# EAGLE design emonTH V1.5.2 (EAGLE 7.0.0)
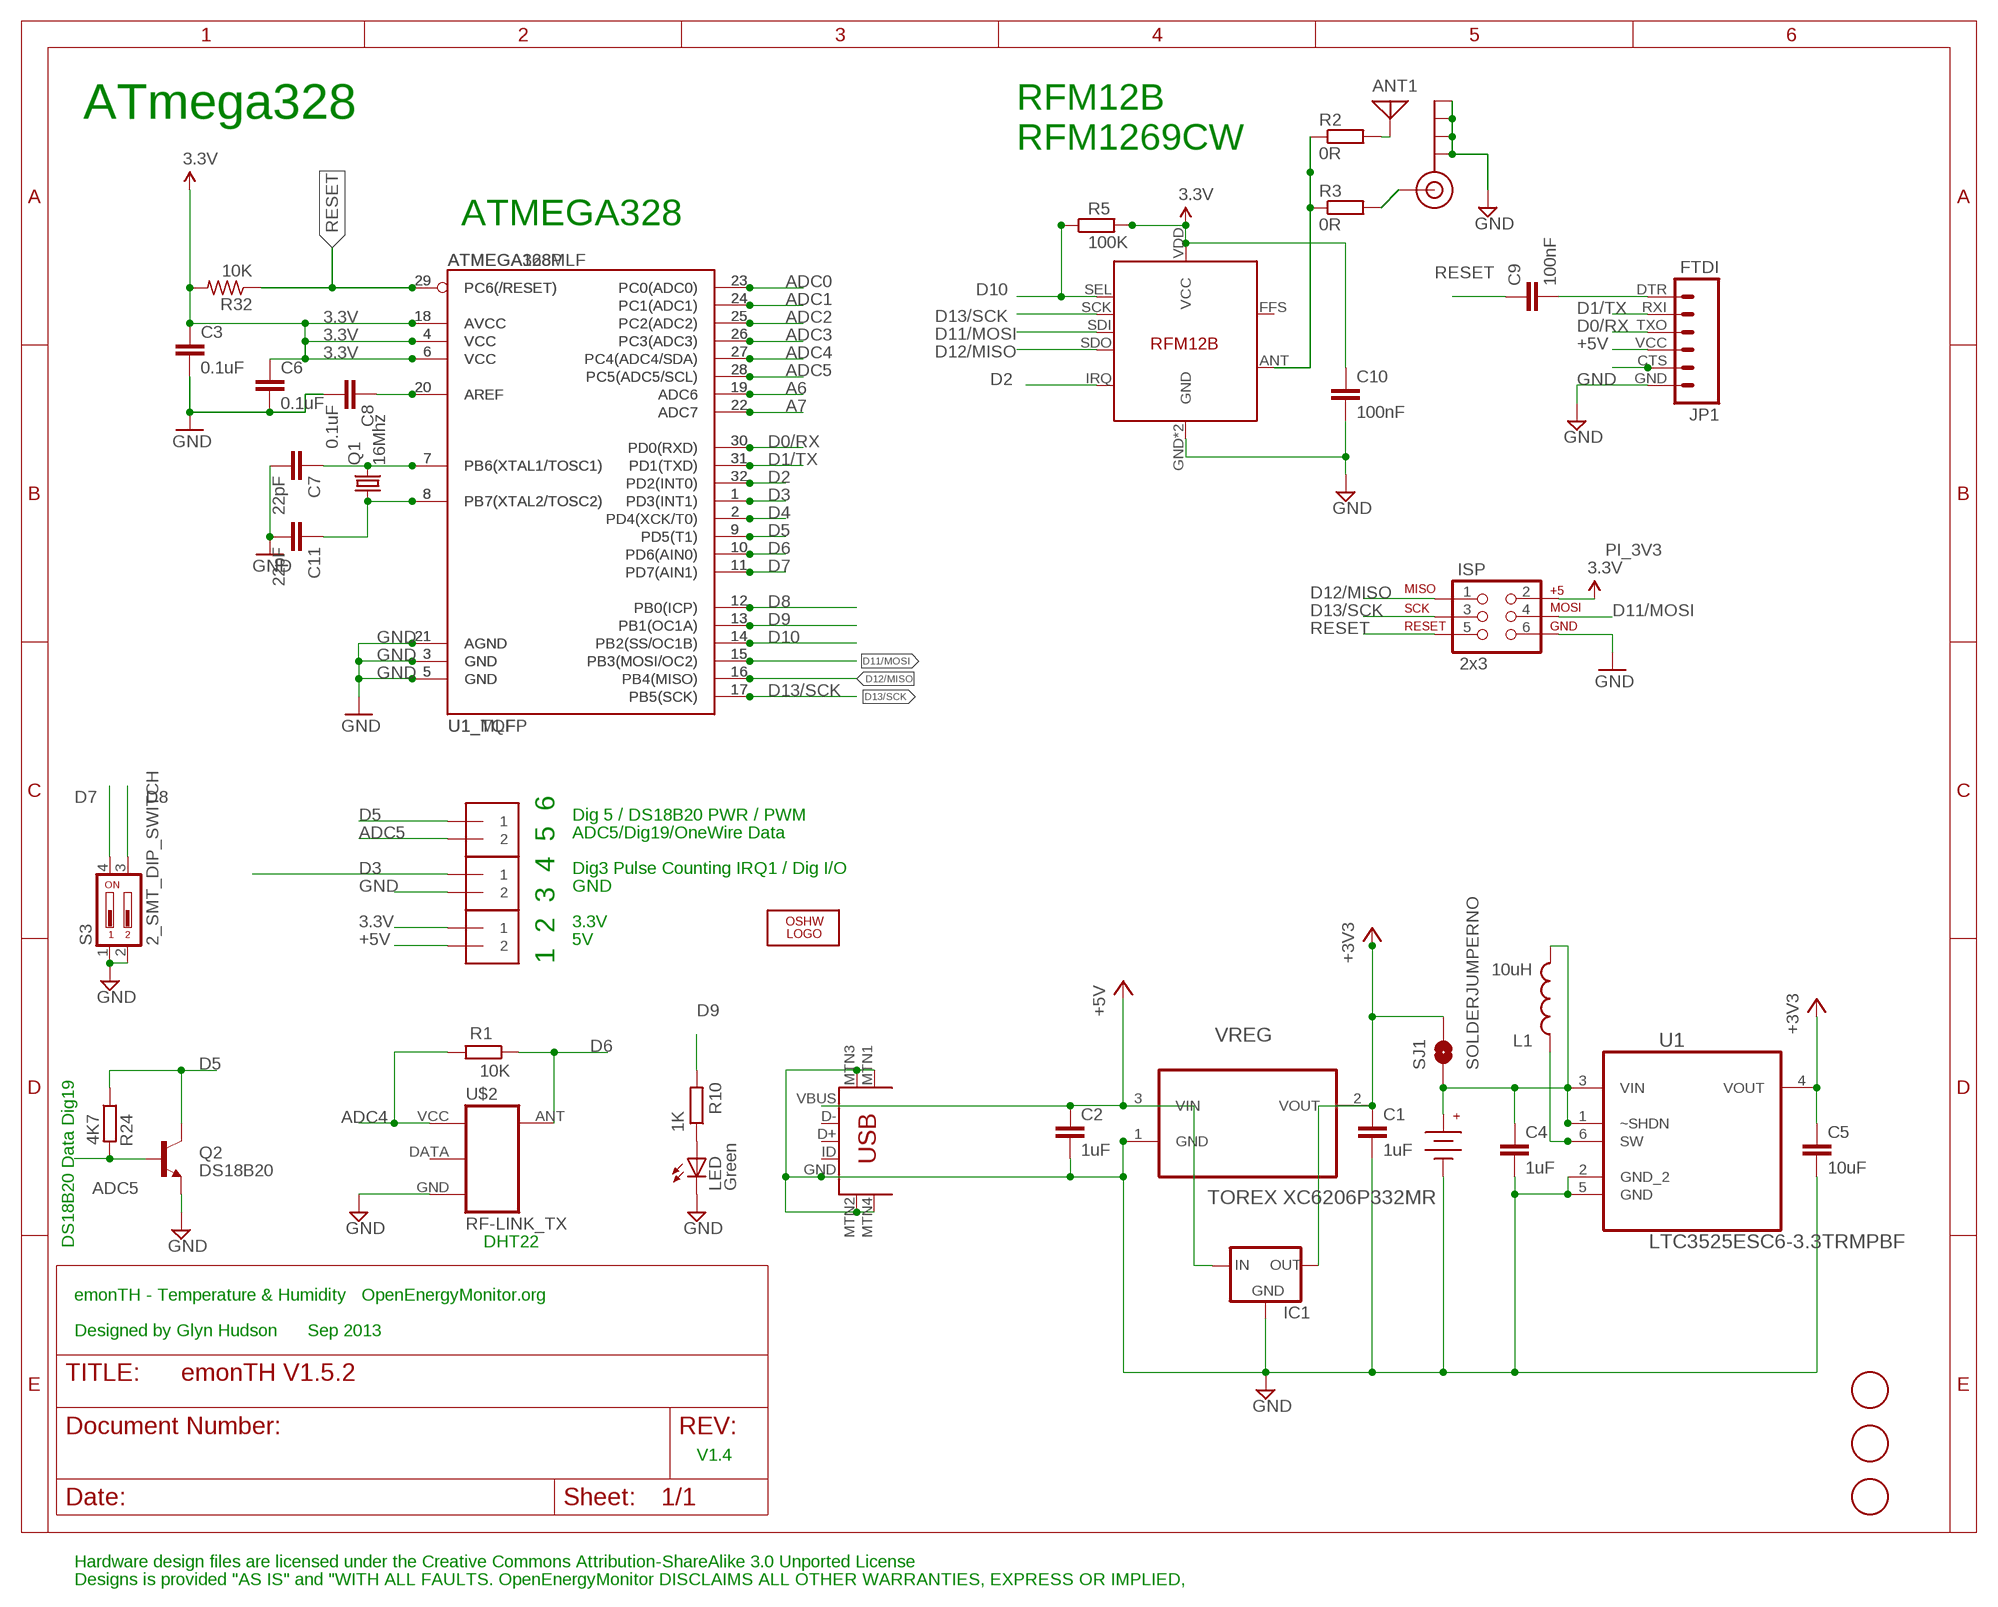
[diagram p0: schematic, sheet 1]

## Parts
ANT1  ANTENNA  [PAD-01]
C1  1uF  C-EUC0603  [C0603]
C2  1uF  C-EUC0603  [C0603]
C3  0.1uF  C-EUC0603  [C0603]
C4  1uF  C-EUC0603  [C0603]
C5  10uF  C-EUC0603  [C0603]
C6  0.1uF  C-EUC0603  [C0603]
C7  22pF  C-EUC0603  [C0603]
C8  0.1uF  C-EUC0603  [C0603]
C9  100nF  C-EUC0603  [C0603]
C10  100nF  C-EUC0603  [C0603]
C11  22pF  C-EUC0603  [C0603]
IC1  78XXS  [78XXS]
ISP  2x3  AVR_SPI_PRG_6PTH  [2X3]
J1  1X2-3.5MM  [1X2-3.5MM]
J2  1X2-3.5MM  [1X2-3.5MM]
J3  1X2-3.5MM  [1X2-3.5MM]
J$1  SMA_EDGE  [SMA-EDGE]
JP1  FTDI  FTDI_BASICPTH  [FTDI_BASIC]
L1  10uH  INDUCTOR1210  [1210]
LED  Green  LEDCHIP-LED0805  [CHIP-LED0805]
LOGO2  OSHW_LOGO_10MILX0200-NT  [OSHW_10X200_NOTEXT]
Q1  16Mhz  CRYSTALHC49UP  [HC49UP]
Q2  DS18B20  TRANSISTOR_NPNTO92  [TO-92]
R1  10K  R-EU_R0603  [R0603]
R2  0R  R-EU_R0603  [R0603]
R3  0R  R-EU_R0603  [R0603]
R5  100K  R-EU_R0603  [R0603]
R10  1K  R-EU_R0603  [R0603]
R24  4K7  R-EU_R0603  [R0603]
R32  10K  R-US_R0603  [R0603]
S3  2_SMT_DIP_SWITCH  [DIP_SWITCH_SMT]
SJ1  SOLDERJUMPERNO  [SJ_2S-NO]
U1  LTC3525ESC6-3.3TRMPBF  [SOT65P210X100-6N]
U1_MLF  ATMEGA168MLF  [MLF32]
U1_TQFP  ATMEGA328P  ATMEGA328_SMT  [TQFP32-08]
U$1  FIDUCIAL  [FIDUCIAL_1MM]
U$2  RF-LINK_TX  [RF-LINK_TX]
U$3  3V  3X_AAA_BATTERY_HOLDER  [AAA_PCB_HOLDER]
U$5  USB-MINIB-5PIN  [USB-MINIB-CISECO]
U$6  FIDUCIAL  [FIDUCIAL_1MM]
U$7  FIDUCIAL  [FIDUCIAL_1MM]
U$14  RFM12B  [RFM12B]
VREG  TOREX XC6206P332MR  MCP1700T-3302E/TT  [SOT95P237X112-3N]

## Nets
3.3V: C1.1 C3.1 C5.1 C6.1 C10.1 IC1.OUT ISP.2 J3.1 R5.2 R32.2 SJ1.2 U1.4(VOUT) U1_MLF.4(VCC) U1_MLF.6(VCC) U1_MLF.18(AVCC) U1_TQFP.4(VCC) U1_TQFP.6(VCC) U1_TQFP.18(AVCC) U$14.VDD(VCC) VREG.2(VOUT) ; supply symbol labelled +3V3
+5V [power]: C2.1 IC1.IN J3.2 JP1.VCC U$5.VBUS VREG.3(VIN)
A6: U1_MLF.19(ADC6) U1_TQFP.19(ADC6)
A7: U1_MLF.22(ADC7) U1_TQFP.22(ADC7)
ADC0: U1_MLF.23(PC0(ADC0)) U1_TQFP.23(PC0(ADC0))
ADC1: C4.1 L1.2 SJ1.1 U1.1(~SHDN) U1.3(VIN) U1_MLF.24(PC1(ADC1)) U1_TQFP.24(PC1(ADC1)) U$3.+
ADC2: U1_MLF.25(PC2(ADC2)) U1_TQFP.25(PC2(ADC2))
ADC3: U1_MLF.26(PC3(ADC3)) U1_TQFP.26(PC3(ADC3))
ADC4: R1.2 U1_MLF.27(PC4(ADC4/SDA)) U1_TQFP.27(PC4(ADC4/SDA)) U$2.VCC(+5V)
ADC5: J1.2 Q2.2(B) R24.2 U1_MLF.28(PC5(ADC5/SCL)) U1_TQFP.28(PC5(ADC5/SCL))
D0/RX: JP1.TXO U1_MLF.30(PD0(RXD)) U1_TQFP.30(PD0(RXD))
D1/TX: JP1.RXI U1_MLF.31(PD1(TXD)) U1_TQFP.31(PD1(TXD))
D2: U1_MLF.32(PD2(INT0)) U1_TQFP.32(PD2(INT0)) U$14.IRQ
D3: J2.1 U1_MLF.1(PD3(INT1)) U1_TQFP.1(PD3(INT1))
D4: U1_MLF.2(PD4(XCK/T0)) U1_TQFP.2(PD4(XCK/T0))
D5: J1.1 Q2.3(C) R24.1 U1_MLF.9(PD5(T1)) U1_TQFP.9(PD5(T1))
D6: R1.1 U1_MLF.10(PD6(AIN0)) U1_TQFP.10(PD6(AIN0)) U$2.ANT
D7: S3.4 U1_MLF.11(PD7(AIN1)) U1_TQFP.11(PD7(AIN1))
D8: S3.3 U1_MLF.12(PB0(ICP)) U1_TQFP.12(PB0(ICP))
D9: R10.2 U1_MLF.13(PB1(OC1A)) U1_TQFP.13(PB1(OC1A))
D10: R5.1 U1_MLF.14(PB2(SS/OC1B)) U1_TQFP.14(PB2(SS/OC1B)) U$14.SEL
D11/MOSI: ISP.4 U1_MLF.15(PB3(MOSI/OC2)) U1_TQFP.15(PB3(MOSI/OC2)) U$14.SDI
D12/MISO: ISP.1 U1_MLF.16(PB4(MISO)) U1_TQFP.16(PB4(MISO)) U$14.SDO
D13/SCK: ISP.3 U1_MLF.17(PB5(SCK)) U1_TQFP.17(PB5(SCK)) U$14.SCK
DIG1: R2.1 R3.1 U$14.ANT
GND [gnd]: C1.2 C2.2 C3.2 C4.2 C5.2 C6.2 C7.2 C8.2 C10.2 C11.2 IC1.GND ISP.6 J2.2 J$1.GND@0(GND) J$1.GND@1(GND) J$1.GND@2(GND) J$1.GND@3(GND) JP1.GND LED.C Q2.1(E) S3.1 S3.2 U1.2(GND_2) U1.5(GND) U1_MLF.3(GND) U1_MLF.5(GND) U1_MLF.21(AGND) U1_TQFP.3(GND) U1_TQFP.5(GND) U1_TQFP.21(AGND) U$2.GND U$3.- U$5.GND U$5.MTN1(MTN2) U$5.MTN2(MTN3) U$5.MTN3(MTN1) U$5.MTN4 U$14.GND U$14.P$12(GND) VREG.1(GND)
N$2: C7.1 Q1.2 U1_MLF.7(PB6(XTAL1/TOSC1)) U1_TQFP.7(PB6(XTAL1/TOSC1))
N$5: L1.1 U1.6(SW)
N$9: C11.1 Q1.1 U1_MLF.8(PB7(XTAL2/TOSC2)) U1_TQFP.8(PB7(XTAL2/TOSC2))
N$11: ANT1.1 R2.2
N$19: JP1.CTS
N$20: C8.1 U1_MLF.20(AREF) U1_TQFP.20(AREF)
N$23: C9.2 JP1.DTR
N$24: J$1.SIG(SIGNAL) R3.2
N$41: LED.A R10.1
RESET: C9.1 ISP.5 R32.1 U1_MLF.29(PC6(/RESET)) U1_TQFP.29(PC6(/RESET))
Unconnected: U$2.DATA U$5.D+ U$5.D- U$5.ID U$14.FFS

## Notes on the sheet
- ATmega328
- RFM12B
  RFM1269CW
- ATMEGA328
- Dig 5 / DS18B20 PWR / PWM
- ADC5/Dig19/OneWire Data
- Dig3 Pulse Counting IRQ1 / Dig I/O
- GND
- 3.3V
- 5V
- 1  2  3  4  5  6
- DS18B20 Data Dig19 | DHT22
- emonTH - Temperature & Humidity   OpenEnergyMonitor.org
- Designed by Glyn Hudson      Sep 2013
- V1.4
- Hardware design files are licensed under the Creative Commons Attribution-ShareAlike 3.0 Unported License
- Designs is provided "AS IS" and "WITH ALL FAULTS. OpenEnergyMonitor DISCLAIMS ALL OTHER WARRANTIES, EXPRESS OR IMPLIED,

## Library data of the parts
ANT1 = discrete:ANTENNA: Antenna
C1 C2 C4-C8 C11 = resistor:C-EU: CAPACITOR, European symbol
C3 C9 C10 = rcl:C-EU: CAPACITOR, European symbol
IC1 = v-reg:78XXS: VOLTAGE REGULATOR
ISP = SparkFun:AVR_SPI_PRG_6: AVR ISP 6 Pin This is the reduced ISP connector for AVR programming. Common on Arduino. This footprint will take up less PCB space and can be used with a 10-pin to 6-pin adapter such as SKU: BOB-08508
J1-J3 = adafruit:1X2: 3.5mm Terminal block http://www.ladyada.net/library/pcb/eaglelibrary.html
J$1 = SparkFun-Connectors:SMA_EDGE: SMA Antenna Connector End launch SMA connector. The paste layer has been removed so that the connector can be hand soldered onto the board after reflow.
JP1 = SparkFun:FTDI_BASIC: FTDI Basic: 3.3V and 5V
L1 = SparkFun:INDUCTOR: Inductors Basic Inductor/Choke - 0603 and 1206. Footprints are not proven and vary greatly between part numbers.
LED = adafruit:LED: LED OSRAM: - CHIPLED LG R971, LG N971, LY N971, LG Q971, LY Q971, LO R971, LY R971 LH N974, LH R974 LS Q976, LO Q976, LY Q976 LO Q996 - Hyper CHIPLED LW Q18S LB Q993, LB Q99A, LB R99A - SideLED LS A670, LO A670, LY A670, LG A670, LP A670 LB A673, LV A673, LT A673, LW A673 LH A674 LY A675 LS A676, LA A676, LO A676, LY A676, LW A676 LS A679, LY A679, LG A679 - Hyper Micro SIDELED® LS Y876, LA Y876, LO Y876, LY Y876 LT Y87S - SmartLED LW L88C, LW L88S LB L89C, LB L89S, LG L890 LS L89K, LO L89K, LY L89K LS L896, LA L896, LO L896, LY L896 - TOPLED LS T670, LO T670, LY T670, LG T670, LP T670 LSG T670, LSP T670, LSY T670, LOP T670, LYG T670 LG T671, LOG T671, LSG T671 LB T673, LV T673, LT T673, LW T673 LH T674 LS T676, LA T676, LO T676, LY T676, LB T676, LH T676, LSB T676, LW T676 LB T67C, LV T67C, LT T67C, LS T67K, LO T67K, LY T67K, LW E67C LS E67B, LA E67B, LO E67B, LY E67B, LB E67C, LV E67C, LT E67C LW T67C LS T679, LY T679, LG T679 LS T770, LO T770, LY T770, LG T770, LP T770 LB T773, LV T773, LT T773, LW T773 LH T774 LS E675, LA E675, LY E675, LS T675 LS T776, LA T776, LO T776, LY T776, LB T776 LHGB T686 LT T68C, LB T68C - Hyper Mini TOPLED® LB M676 - Mini TOPLED Santana® LG M470 LS M47K, LO M47K, LY M47K Source: http://www.osram.convergy.de/
LOGO2 = ohw-logo:OSHW_LOGO_10MIL
Q1 = adafruit:CRYSTAL: CRYSTAL; OC_FARNELL: unknown; OC_NEWARK: unknown
Q2 = SparkFun:TRANSISTOR_NPN: Transistor NPN BJT configuration in SOT23 package. MMBT2222 is the common NPN we use. Double check BCE configuration again layout.
R1 R10 R24 = resistor:R-EU_: RESISTOR, European symbol
R2 R3 R5 = rcl:R-EU_: RESISTOR, European symbol
R32 = adafruit:R-US_: RESISTOR, American symbol
S3 = OpenEnergyMonitor:2_SMT_DIP_SWITCH: Multicomp MCEMR-02-T 2 throw SMT DIP switch, Farnell 1524005
SJ1 = SparkFun:SOLDERJUMPER: Solder Jumper Standard SMD solder jumper. Used to automate production. Two varients : Normally Open and Normally Closed are the same, but have different paste layers. NC will have a large amount of paste and should jumper during reflow.
U1 = LTC3525:LTC3525ESC6-3.3TRMPBF: Step-Up DC/DC Converter; MPN: LTC3525ESC6-3.3#TRMPBF; OC_FARNELL: 1663904; OC_NEWARK: 19P0692; PACKAGE: SC70-6; SUPPLIER: LINEAR TECHNOLOGY
U1_MLF = SparkFun-DigitalIC:ATMEGA168: Atmel 32-pin 8-bit micro, 16k flash.
U1_TQFP = SparkFun-DigitalIC:ATMEGA328_SMT: 32-Pin Atmega328 part Commonly used on Arduino compatible boards Available in QFP and QFN packages TQFP is IC-09069 QFN is non-stock; PROD_ID: IC-09069
U$1 U$6 U$7 = adafruit:FIDUCIAL: For use by pick and place machines to calibrate the vision/machine, 1mm By microbuilder.eu
U$2 = SparkFun:RF-LINK_TX
U$3 = Battery Holders_2xAA:3X_AAA_BATTERY_HOLDER: 2x AA Battery Holder; RAPID_OC: 18-2967
U$5 = Ciseco USB miniB_Updated:USB-MINIB: Mini-USB "B" connector with 5th pin broken out. Created new symbol breaking out 5th "ID" pin in mini/micro USB connector spec. See: http://en.wikipedia.org/wiki/Mini_usb#Cables. Uses same footprint as 4-pin symbol. Also added pins to connect to mounting / shield pads if required (probably not generally needed as signals aren't shielded once they leave the connector). Modified by Ciseco for Rapid Part 24-0357
U$14 = JeeParts:RFM12B
VREG = Farnell_MCP1700-SOT23:MCP1700T-3302E/TT: Low Quiescent Current LDO; MPN: MCP1700T-3302E/TT; OC_FARNELL: 1296592; OC_NEWARK: 88H9817; PACKAGE: SOT23-3; SUPPLIER: Microchip

## Net classes
0 default: width 0.203 mm, drill 0.6 mm, clearance 0.203 mm
1 power: width 0.305 mm, drill 0.6 mm, clearance 0.254 mm
2 gnd: width 0.254 mm, drill 0.6 mm, clearance 0.254 mm

## Board
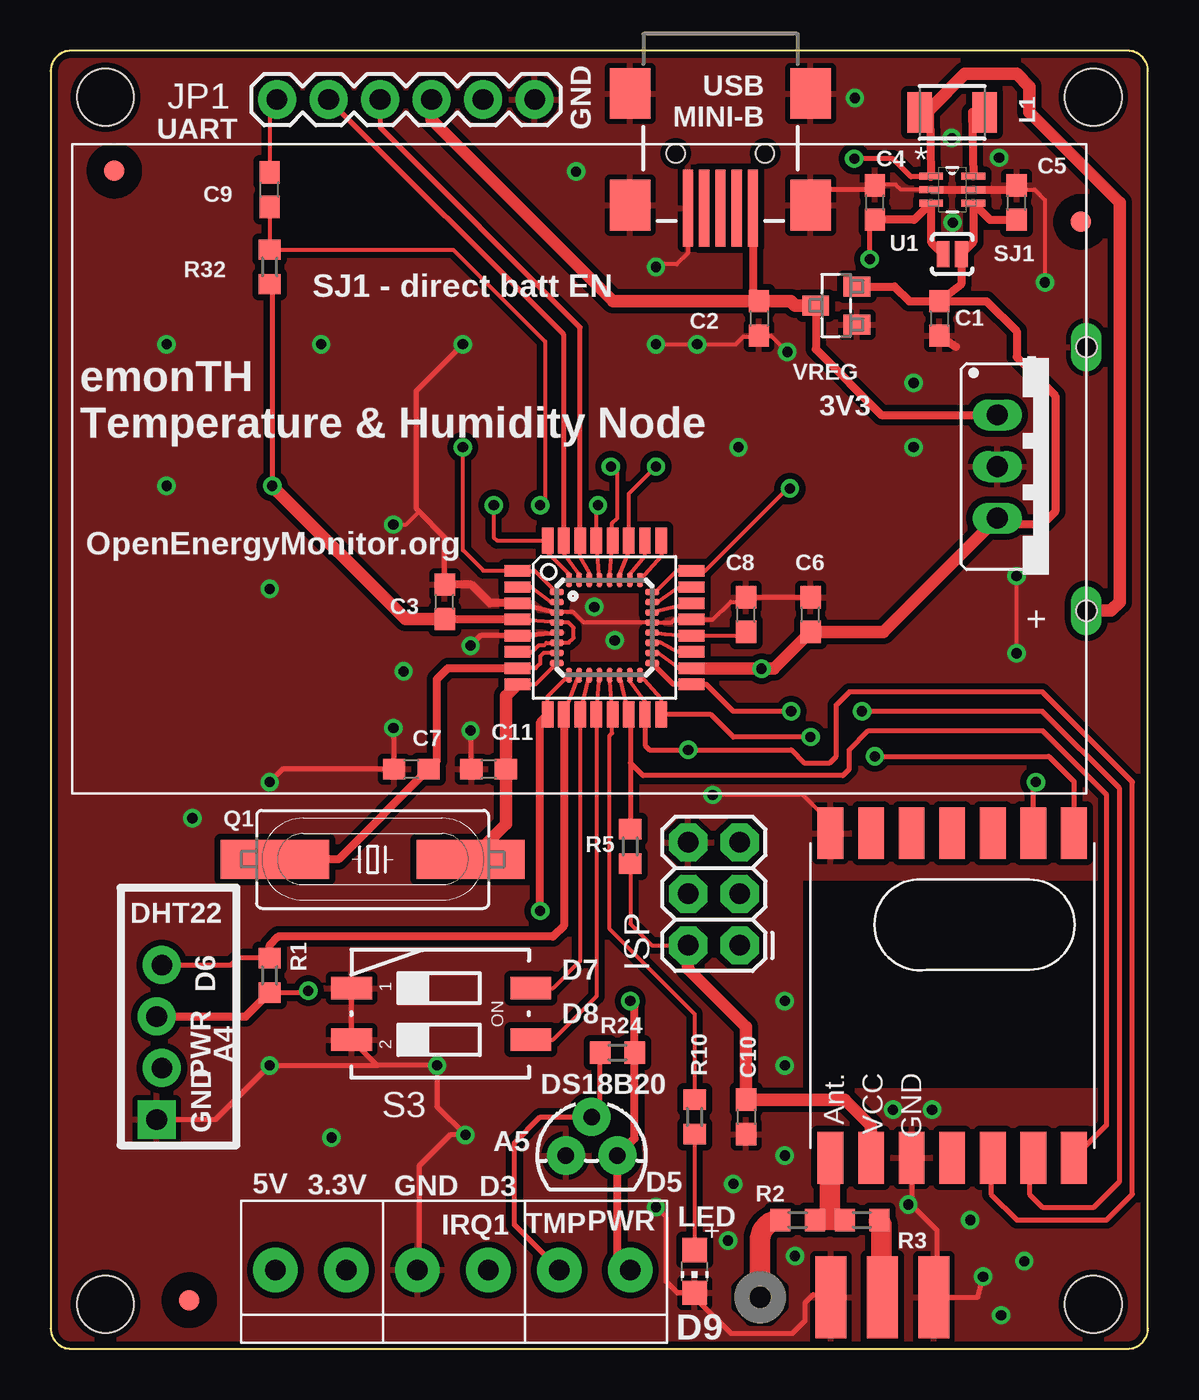
[diagram p1: board, top side]
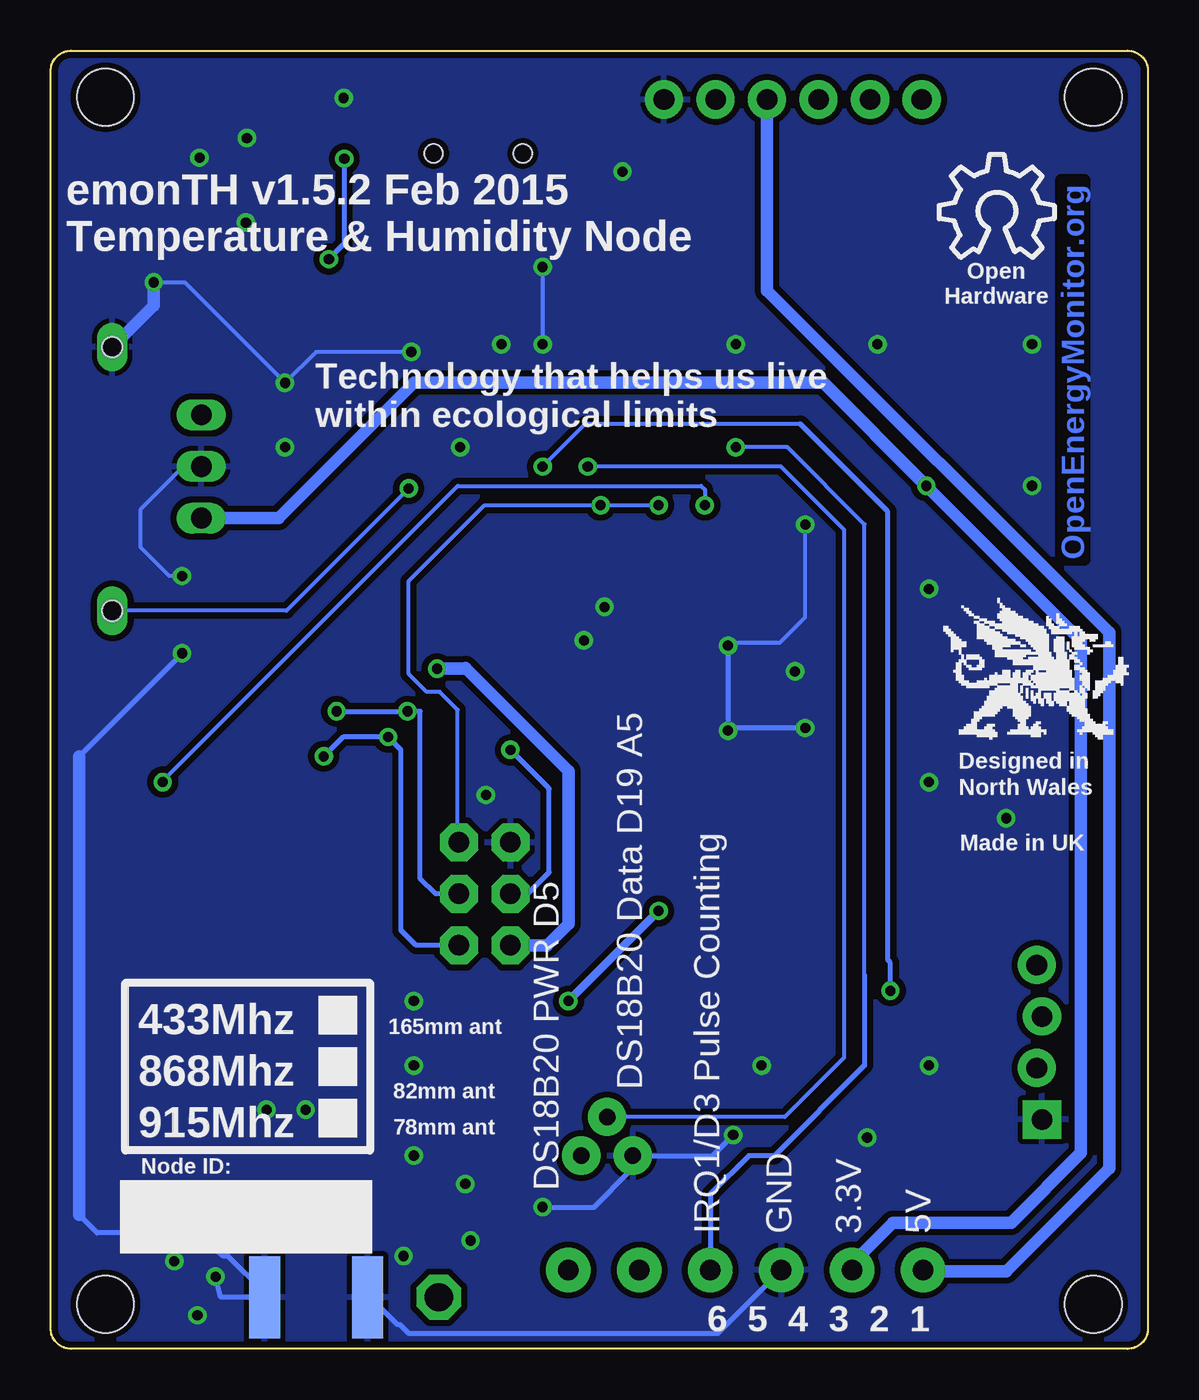
[diagram p2: board, bottom side, seen from below]

Size 54.1 x 64 mm. Coordinates in mm from the lower left corner, seen from the top.
Outline: 53.1,64 1,64 arc90 0,63 0,1 arc90 1,0 53.1,0 arc90 54.1,1 54.1,63 arc90 53.1,64
Copper layers (1*16): Top 0.035mm / dielectric 1.5mm / Bottom 0.035mm
Design rules "default *": minimum track width 8mil, minimum drill 0.5mm, track to track 8mil, track to pad 8mil, pad to pad 8mil, via to via 8mil, smd to smd 8mil, copper to edge 10mil, drill to drill 8mil, minimum pad ring 8mil, minimum via ring 8mil, stop-mask expansion 0.075mm, vias tented up to drill 0.6mm, thermal gap 10mil
Holes 2.8 mm at 2.7,2.2 2.7,61.7 51.4,61.7 51.4,2.2

### Footprints (pad centres in the part's own frame; a part is rotated, then mirrored left to right if it is on the bottom)
PAD-01 = drill 1.4 pad 2.2 octagon: 1 0,0
C0603 = smd 1.1 x 1: 1 -0.85,0; 2 0.85,0
78XXS = drill 1.016 long: GND 0,-2.54; IN -2.54,-2.54; OUT 2.54,-2.54
2X3 = drill 1.016 pad 1.88 octagon: 1 0,0; 2 0,2.54; 3 2.54,0; 4 2.54,2.54; 5 5.08,0; 6 5.08,2.54
1X2-3.5MM = drill 1 pad 2.184: 1 1.8,0; 2 -1.7,0
SMA-EDGE = smd 1.524 x 4.064: GND@0 0,0; GND@1 5.08,0; SIG 2.54,0 | smd 1.524 x 4.064 bottom: GND@2 0,0; GND@3 5.08,0
FTDI_BASIC = drill 1.016 pad 1.88: CTS 10.16,0; DTR 0,0; GND 12.7,0; RXI 2.54,0; TXO 5.08,0; VCC 7.62,0
1210 = smd 1.2 x 2: 1 -1.6,0; 2 1.6,0
CHIP-LED0805 = smd 1.2 x 1.2: A 0,-1.05; C 0,1.05
HC49UP = smd 5.334 x 1.93: 1 -4.826,0; 2 4.826,0
TO-92 = drill 0.813 pad 1.88: 1 -1.27,0; 2 0,1.905; 3 1.27,0
R0603 = smd 1 x 1.1: 1 -0.85,0; 2 0.85,0
DIP_SWITCH_SMT = smd 1.1 x 2: 1 -1.27,-4.215; 2 1.27,-4.215; 3 1.27,4.615; 4 -1.27,4.615
SJ_2S-NO = smd 0.635 x 1.27: 1 -0.45,0; 2 0.45,0
SOT65P210X100-6N = smd 1.168 x 0.356: 1 -1.041,0.66; 2 -1.041,0; 3 -1.041,-0.66; 4 1.041,-0.66; 5 1.041,0; 6 1.041,0.66
MLF32 = smd 0.7 x 0.3: 1 -2.35,1.75; 2 -2.35,1.25; 3 -2.35,0.75; 4 -2.35,0.25; 5 -2.35,-0.25; 6 -2.35,-0.75; 7 -2.35,-1.25; 8 -2.35,-1.75; 17 2.35,-1.75; 18 2.35,-1.25; 19 2.35,-0.75; 20 2.35,-0.25; 21 2.35,0.25; 22 2.35,0.75; 23 2.35,1.25; 24 2.35,1.75 | smd 0.3 x 0.7: 9 -1.75,-2.35; 10 -1.25,-2.35; 11 -0.75,-2.35; 12 -0.25,-2.35; 13 0.25,-2.35; 14 0.75,-2.35; 15 1.25,-2.35; 16 1.75,-2.35; 25 1.75,2.35; 26 1.25,2.35; 27 0.75,2.35; 28 0.25,2.35; 29 -0.25,2.35; 30 -0.75,2.35; 31 -1.25,2.35; 32 -1.75,2.35
TQFP32-08 = smd 1.27 x 0.559: 1 -4.293,2.8; 2 -4.293,2; 3 -4.293,1.2; 4 -4.293,0.4; 5 -4.293,-0.4; 6 -4.293,-1.2; 7 -4.293,-2; 8 -4.293,-2.8; 17 4.293,-2.8; 18 4.293,-2; 19 4.293,-1.2; 20 4.293,-0.4; 21 4.293,0.4; 22 4.293,1.2; 23 4.293,2; 24 4.293,2.8 | smd 0.559 x 1.27: 9 -2.8,-4.293; 10 -2,-4.293; 11 -1.2,-4.293; 12 -0.4,-4.293; 13 0.4,-4.293; 14 1.2,-4.293; 15 2,-4.293; 16 2.8,-4.293; 25 2.8,4.293; 26 2,4.293; 27 1.2,4.293; 28 0.4,4.293; 29 -0.4,4.293; 30 -1.2,4.293; 31 -2,4.293; 32 -2.8,4.293
FIDUCIAL_1MM = smd 1 x 1: 1 0,0
RF-LINK_TX = drill 1.016 pad 1.88: ANT 7.62,-0.127; DATA 2.54,-0.127; VCC 5.08,0.127 | drill 1.016 pad 1.88 square: GND 0,0.127
AAA_PCB_HOLDER = drill 1 long: + 0,9; - 0,22 | hole 1: 0,9; 0,22
USB-MINIB-CISECO = smd 3.8 x 0.5: D+ 7.9,0; D- 7.9,0.8; GND 7.9,-1.6; ID 7.9,-0.8; VBUS 7.9,1.6 | smd 2.5 x 2: MTN1 2.25,4.45; MTN2 7.75,4.45; MTN3 2.25,-4.45; MTN4 7.75,-4.45 | hole 0.9: 5.2,2.2; 5.2,-2.2
RFM12B = smd 2.54 x 1.27: ANT 8,-6; FFS -8,2; GND 8,-2; IRQ -8,4; P$8 -8,0; P$9 -8,-2; P$10 -8,-4; P$12 -8,-6; P$16 8,0; SCK 8,4; SDI 8,2; SDO -8,6; SEL 8,6; VDD 8,-4
SOT95P237X112-3N = smd 0.991 x 1.321: 1 -0.94,-1.016; 2 0.94,-1.016; 3 0,1.016

### Placement (x,y rotation side)
ANT1  34.97,2.54 0 top
C1  43.81,50.8 270 top
C2  34.92,50.8 270 top
C3  19.43,36.83 90 top
C4  40.64,56.52 90 top
C5  47.62,56.52 90 top
C6  37.47,36.2 90 top
C7  17.78,28.57 180 top
C8  34.29,36.2 90 top
C9  10.79,57.15 90 top
C10  34.29,11.43 270 top
C11  21.59,28.57 180 top
IC1  49.21,43.5 270 top
ISP  33.97,19.89 90 top
J1  26.78,3.89 0 top
J2  19.78,3.89 0 top
J3  12.78,3.89 0 top
J$1  43.55,2.54 180 top
JP1  11.16,61.59 0 top
L1  44.45,60.96 180 top
LED  31.75,3.81 180 top
LOGO2  10.29,53.81 0 bottom
Q1  15.88,24.13 180 top
Q2  26.67,9.53 0 top
R1  10.79,18.41 270 top
R2  36.83,6.35 180 top
R3  40.01,6.35 0 top
R5  28.57,24.77 270 top
R10  31.75,11.43 90 top
R24  27.94,14.61 180 top
R32  10.79,53.34 270 top
S3  19.05,16.51 270 top
SJ1  44.45,53.98 0 top
U1  44.45,57.15 0 top
U1_MLF  27.3,35.56 0 top
U1_TQFP  27.3,35.56 0 top
U$1  6.83,2.4 0 top
U$2  5.35,11.3 90 top
U$3  51.07,27.39 0 top
U$5  33.02,64.14 270 top
U$6  3.13,58.08 0 top
U$7  50.8,55.56 0 top
U$14  44.45,17.41 270 top
VREG  38.73,51.44 90 top

### Tracks (layer width: path | path; a pad name or v marks a point on that pad's centre or on a via)
3.3V  (via drill 0.5)
  Top 0.203: 28.57,24.13 28.57,20.95 29.64,19.89 ISP.2 | U1_TQFP.4 U1_MLF.4 25.53,35.81 25.78,35.56 25.78,35.05 25.54,34.81 U1_MLF.6 24.94,34.8 24.43,34.8 24.33,34.7 24.08,34.7 23.74,34.36 U1_TQFP.6 | U1_MLF.18 29.95,34.31 30.96,33.56 U1_TQFP.18 31.63,33.53
  Top 0.254: R32.2 10.92,52.36 v10.92,42.55
  Top 0.406: C1.1 44.9,52.48 SJ1.2 45.49,54.57 U1.4 46.32,55.66 C5.1 | VREG.2 41.6,52.38 42.33,51.65 C1.1 | C1.1 46.14,51.65 47.62,50.16 47.62,48.9 49.53,46.99 49.53,41.27 48.9,40.64 46.99,40.64 IC1.OUT | C3.1 22.99,35.98 U1_TQFP.4
  Top 0.61: U$14.VDD 40.45,10.98 39.16,12.28 C10.1 34.29,15.88 31.43,18.73 ISP.2 | IC1.OUT 41.06,35.34 C6.1 35.65,33.53 v35.05,33.53 31.63,33.53 | R5.2 28.57,24.13 | C3.1 17.49,35.98 v10.92,42.55
  Bottom 0.203: 33.66,33.56 33.69,33.53
  Bottom 0.61: ISP.2 29.64,19.89 28.57,20.95 28.57,28.48 33.66,33.56 | IC1.OUT 42.86,40.96 36.2,47.62 16,47.62 v10.92,42.55 3.3,34.92 3.3,9.65 6.73,6.22 12.57,6.22 14.58,4.22 J3.1 | 33.69,33.53 v35.05,33.53
+5V
  Top 0.254: 34.62,51.65 C2.1
  Top 0.406: U$5.VBUS 34.62,51.65 | VREG.3 37.72,49.28 40.96,46.04 IC1.IN
  Top 0.61: JP1.VCC 18.78,60.59 27.73,51.65 C2.1 36.49,51.65 36.7,51.44 VREG.3
  Bottom 0.61: J3.2 11,3.81 6.99,3.81 1.91,8.89 1.91,35.31 18.78,52.18 JP1.VCC
A6
  Top 0.203: U1_TQFP.19 30.92,34.36 30.09,34.81 U1_MLF.19
A7
  Top 0.203: U1_TQFP.22 U1_MLF.22
ADC0
  Top 0.203: U1_TQFP.23 31.5,37.47 30.86,37.47 29.95,36.81 U1_MLF.23
ADC1  (via drill 0.5)
  Top 0.203: U1_MLF.24 29.82,37.31 30.86,38.35 U1_TQFP.24 32.26,38.35 36.32,42.42 v36.45,42.42
  Top 0.254: 43.38,57.78 42.42,57.78 41.53,58.67 v39.62,58.67 | v40.39,53.72 40.39,55.41 C4.1
  Top 0.406: L1.2 43.34,60.97 | 43.34,60.97 U1.1 43.38,57.78 | SJ1.1 43.41,54.57 U1.3 42.58,55.66 C4.1 | 43.34,60.97 43.34,61.12
  Top 0.61: U$3.+ 52.26,36.39 52.7,36.83 52.7,56.52 48.26,60.96 48.26,62.23 47.62,62.87 45.09,62.87 43.34,61.12
  Bottom 0.203: v36.45,42.42 42.48,36.39 U$3.+
  Bottom 0.254: v39.62,58.67 39.62,54.48 v40.39,53.72
ADC2
  Top 0.203: U1_TQFP.25 30.11,39.09 U1_MLF.25
ADC3
  Top 0.203: U1_MLF.26 28.57,37.93 28.57,38.23 29.3,39.08 U1_TQFP.26
ADC4  (via drill 0.5)
  Top 0.203: U1_MLF.27 28.07,37.92 28.07,38.23 28.5,39.3 U1_TQFP.27 28.5,42.16 v29.84,43.5
  Top 0.254: R1.2 12.61,17.57 v12.7,17.65
  Top 0.406: U$2.VCC 9.61,16.38 R1.2
  Bottom 0.203: 17.14,45.59 27.75,45.59 v29.84,43.5
  Bottom 0.254: 17.14,45.59 12.83,41.27 12.83,19.18 12.7,19.05 v12.7,17.65
ADC5  (via drill 0.5)
  Top 0.203: U1_MLF.28 U1_TQFP.28 27.69,39.87 27.69,40.7 27.94,40.96 27.94,43.18 v27.62,43.5
  Top 0.254: R24.2 27.09,11.85 Q2.2 24.13,11.43 22.86,10.16 22.86,6.1 J1.2
  Bottom 0.203: Q2.2 17.91,11.43 14.99,14.35 14.99,40.39 18.1,43.5 v27.62,43.5
D0/RX
  Top 0.203: U1_MLF.30 26.55,38.22 26.11,39.05 U1_TQFP.30
  Top 0.254: U1_TQFP.30 26.11,50.35 16.26,60.2 16.26,61.58 JP1.TXO
D1/TX
  Top 0.203: U1_MLF.31 26.05,38.21 25.3,39.21 U1_TQFP.31
  Top 0.254: U1_TQFP.31 25.3,49.99 JP1.RXI
D2  (via drill 0.5)
  Top 0.203: U1_MLF.32 25.53,37.94 25.53,38.23 24.5,39.25 U1_TQFP.32 22,39.85 21.84,40.01 v21.84,41.59
  Top 0.254: U$14.IRQ 48.45,27.81 v48.58,27.94
  Bottom 0.203: v48.58,27.94 48.58,28 34.04,42.55 22.04,42.55 21.84,42.35 v21.84,41.59
D3  (via drill 0.5)
  Top 0.203: 24.77,37.47 U1_MLF.1 24.92,37.31 23.88,38.35 U1_TQFP.1 21.33,38.36 20.32,39.37 v20.32,44.45
  Bottom 0.203: 13.97,18.41 13.97,40.64 17.78,44.45 v20.32,44.45
  Bottom 0.254: 13.97,18.41 13.97,13.97 18.41,9.53 19.68,9.53 21.58,7.63 J2.1
D4
  Top 0.203: U1_MLF.2 24.93,36.83 24.64,36.83 23.65,37.56 U1_TQFP.2
D5  (via drill 0.5)
  Top 0.203: U1_TQFP.9 24.5,32.16 U1_MLF.9
  Top 0.406: v24.13,21.59 24.13,30.89 U1_TQFP.9 | J1.1 27.94,4.52 Q2.3 28.79,10.38 R24.1 28.79,16.93 v28.57,17.14
  Bottom 0.406: v24.13,21.59 v28.57,17.14
D6
  Top 0.203: U1_TQFP.10 U1_MLF.10
  Top 0.254: U$2.ANT 8.89,18.92 9.27,19.3 10.76,19.3 R1.1
  Top 0.406: U1_TQFP.10 25.3,20.86 24.77,20.32 11.21,20.32 10.79,19.9 R1.1
D7
  Top 0.203: U1_MLF.11 U1_TQFP.11 26.11,19.12 24.77,17.78 S3.4
D8
  Top 0.203: U1_MLF.12 U1_TQFP.12 26.91,17.38 24.77,15.24 S3.3
D9
  Top 0.203: U1_MLF.13 U1_TQFP.13 27.69,31.25 27.69,30.35 27.56,30.23 27.56,20.7 31.75,16.51 R10.2
D10
  Top 0.203: U1_TQFP.14 U1_MLF.14
  Top 0.254: U$14.SEL 52.07,11.04 52.07,27.3 48.9,30.48 40.32,30.48 39.37,29.53 39.37,28.57 39.05,28.26 29.21,28.26 28.57,28.89 | U1_TQFP.14 28.57,31.2 28.57,28.89 | 28.57,28.89 R5.1
D11/MOSI  (via drill 0.5)
  Top 0.203: U1_TQFP.15 29.3,31.91 28.55,32.91 U1_MLF.15
  Top 0.254: U$14.SDI 46.35,9.32 46.35,7.62 47.62,6.35 52.07,6.35 53.34,7.62 53.34,27.94 48.9,32.38 39.37,32.38 38.73,31.75 38.73,29.21 38.42,28.89 37.15,28.89 36.51,29.53 v31.43,29.53 29.53,29.53 29.3,29.75 U1_TQFP.15
  Bottom 0.254: ISP.4 30.59,22.43 29.53,23.5 29.53,27.62 v31.43,29.53
D12/MISO  (via drill 0.5)
  Top 0.203: U1_TQFP.16 30.11,32.03 U1_MLF.16
  Top 0.254: v37.47,30.16 33.66,30.16 32.55,31.27 U1_TQFP.16 | v40.64,29.21 49.21,29.21 50.45,27.97 U$14.SDO
  Bottom 0.254: ISP.1 36.08,19.89 36.83,20.64 36.83,29.53 v37.47,30.16 39.69,30.16 v40.64,29.21
D13/SCK  (via drill 0.5)
  Top 0.254: U$14.SCK 48.26,9.22 48.26,7.62 48.9,6.99 51.44,6.99 52.7,8.26 52.7,27.62 48.9,31.43 v40.01,31.43 | U1_TQFP.17 31.97,32.7 | U1_TQFP.17 30.7,32.76 U1_MLF.17 | 31.66,32.7 U1_TQFP.17 | v36.51,31.43 33.66,31.43 32.33,32.76 U1_TQFP.17
  Bottom 0.254: ISP.3 35.13,22.43 35.88,23.18 35.88,31.43 v36.51,31.43 v40.01,31.43
DIG1
  Top 1.016: U$14.ANT 38.42,9.38 38.42,6.35 | 38.42,6.35 R2.1 | 38.42,6.35 R3.1
GND  (via drill 0.5)
  Top 0.203: U$5.GND 31.42,54.03 30.86,53.47 29.97,53.47 v29.84,53.34 | v29.84,49.53 33.78,49.53 34.16,49.91 34.89,49.91 C2.2 35.52,49.95 v36.32,49.15 | 47.47,57.15 48.51,57.15 49.02,56.64 v49.02,52.58 | U1.2 41.91,57.15 41.66,57.4 40.68,57.4 C4.2 | C8.2 34.08,36.83 33.53,36.83 32.66,35.96 U1_TQFP.21 31.58,35.94 30.73,35.94 30.6,35.81 U1_MLF.21 26.29,35.81 25.78,36.32 24.97,36.32 U1_MLF.3 | v47.62,34.29 v47.62,38.1 | U$14.P$12 38.45,25.94 37.08,27.3 v32.64,27.3 | v16.89,40.64 17.53,40.64 18.16,41.27
  Top 0.254: U1_MLF.5 U1_TQFP.5 21.19,35.16 v20.7,34.67 | U1_TQFP.3 U1_MLF.3 | 40.64,57.15 38.23,57.15 U$5.MTN2 | v20.7,30.48 20.7,28.61 C11.2 | v16.89,30.61 16.93,30.57 C7.2 11.43,28.57 v10.79,27.94 | C3.2 19.43,40.01 18.16,41.27 18.03,41.4 18.03,47.24 v20.32,49.53 | U$2.GND 8.13,11.3 v10.79,13.97 16.11,13.97 | S3.1 S3.2 16.11,13.97 | J2.2 18.16,3.97 18.16,9.02 19.68,10.54 v20.45,10.54 19.05,11.94 v19.05,13.97 16.11,13.97 | v29.84,6.99 30.35,6.48 30.35,3.3 30.89,2.76 LED.C 31.75,2.54 33.53,0.76 36.58,0.76 37.21,1.4 37.21,2.29 37.59,2.67 38.34,2.67 J$1.GND@1 | v45.97,3.56 45.72,2.54 J$1.GND@2 43.69,2.68 43.69,5.84 42.45,7.08 U$14.GND | C6.2 C8.2
  Top 0.406: C5.2 47.47,57.15 U1.5 U1.2 | 44.63,49.39 C1.2 | C4.2 40.64,57.15 | U1_TQFP.3 21.66,36.76 20.74,37.68 C3.2
  Bottom 0.203: v29.84,53.34 v29.84,49.53 | v36.32,49.15 41.02,49.15 v42.55,47.62 47.5,52.58 v49.02,52.58 | v47.62,38.1 48.26,38.1 49.66,39.5 49.66,41.4 47.5,43.56 46.74,43.56 IC1.GND | v20.7,34.67 20.57,34.8 18.16,34.8 16.89,36.07 v16.89,40.64
  Bottom 0.254: v20.7,34.67 v20.7,30.48 20.57,30.61 v16.89,30.61 | v20.45,10.54 21.46,9.53 Q2.1 25.53,9.4 25.53,8.76 27.3,6.99 v29.84,6.99 | v45.97,3.56 45.72,2.54 J$1.GND@2 43.55,2.78 45.34,4.57 45.59,4.57 46.74,5.71 51.82,5.71 52.7,6.6 | J$1.GND@1 38.35,2.54 37.02,1.21 36.89,1.21 36.45,0.76 21.2,0.76 J2.2 | 52.7,29.21 v47.62,34.29
  Bottom 0.61: U$3.- 51.05,49.4 49.02,51.44 v49.02,52.58 | 52.7,6.6 52.7,29.21
  other vias: 5.71,49.53 13.34,49.53 42.55,44.45 5.71,42.55 10.79,37.47 36.2,13.97 36.2,17.14 36.2,9.53 42.29,7.11 48.01,4.32 46.86,1.65 33.66,8.13 13.84,10.41 6.99,26.16 17.4,33.4 26.8,36.58 27.81,34.92 25.91,58.04 31.88,49.53 33.91,44.45 33.4,5.33 36.7,4.57 45.34,6.35 41.53,11.79 43.46,11.79 44.42,59.69 46.76,58.72 39.65,61.67 44.48,55.52
  pour Bottom (isolate 0.305): -0.13,-0.13 54.1,-0.13 54.1,7.62 53.98,7.87 54.23,25.27 54.1,27.56 54.1,64.14 -0.13,64.14
  pour Top (isolate 0.305): 0,0 54.1,0 54.1,12.7 36.96,12.7 36.96,23.24 54.1,23.24 54.1,64.01 0,64.01
N$2
  Top 0.203: U1_TQFP.7 23.91,33.56 24.13,33.78 24.13,34.14 24.3,34.31 U1_MLF.7
  Top 0.406: Q1.2 14.19,24.13 C7.1 19.05,29 19.05,33.02 19.59,33.56 U1_TQFP.7
N$5
  Top 0.406: L1.1 45.43,60.97 U1.6
N$9
  Top 0.203: U1_MLF.8 23.91,32.76 U1_TQFP.8
  Top 0.406: 20.74,23.53 Q1.1
  Top 0.559: U1_TQFP.8 22.44,32.19
  Top 0.61: 22.44,32.19 C11.1 22.44,25.87 Q1.1
N$11
  Top 1.016: R2.2 arc90 34.97,5.34 ANT1.1
N$20
  Top 0.203: C8.1 arc-90 34.21,35.16 U1_TQFP.20 arc-9 U1_MLF.20
N$23
  Top 0.203: JP1.DTR 10.79,61.23 C9.2
N$24
  Top 1.016: R3.2 arc90 40.96,6.13 40.96,3.17 arc-90 41.01,3.13 J$1.SIG
N$41
  Top 0.203: R10.1 LED.A
RESET  (via drill 0.5)
  Top 0.203: C9.1 R32.1 19.85,54.19 24.38,49.66 24.38,41.85 v24.13,41.59 | U1_MLF.29 U1_TQFP.29 26.91,41.51 v26.99,41.59
  Bottom 0.203: ISP.5 34.04,25.04 34.04,31.5 34.92,32.38 35.56,32.38 36.45,33.27 36.45,37.85 32.7,41.59 v26.99,41.59 v24.13,41.59

### Text on the board
Bottom: OpenEnergyMonitor.org
tPlace: USB / MINI-B | UART | GND | 3V3 | DHT22 | D6 | D7 | PWR | A4 | D8 | DS18B20 | GND | A5 | 5V | 3.3V | GND | D3 | D5 | IRQ1 | TMP | PWR | LED | D9
bPlace: emonTH v1.5.2 Feb 2015 / Temperature & Humidity Node | Open / Hardware | Technology that helps us live / within ecological limits | Designed in | North Wales | Made in UK | DS18B20 Data D19 A5 | DS18B20 PWR D5 | 5V | 3.3V | GND | IRQ1/D3 Pulse Counting | 6 5 4 3 2 1
bNames: 165mm ant | 433Mhz | 868Mhz | 82mm ant | 78mm ant | 915Mhz | Node ID:
dxf: Note: v1.5 PCB Dimensions have been / widened so that drill holes are 48.7mm / appart to match case dimensions | REAR GRILL 35mm | FRONT GRILL 35mm
tSilk: SJ1 - direct batt EN | emonTH / Temperature & Humidity Node | OpenEnergyMonitor.org
_tsilk: Designed in | North Wales | Made in UK
_bsilk: 165mm ant | 433Mhz | 165mm ant | 165mm ant | 433Mhz | 433Mhz | 868Mhz | 82mm ant | 82mm ant | 82mm ant | 868Mhz | 868Mhz | 78mm ant | 915Mhz | 78mm ant | 915Mhz | 78mm ant | 915Mhz | 165mm ant | 433Mhz | 82mm ant | 868Mhz | 78mm ant | 915Mhz